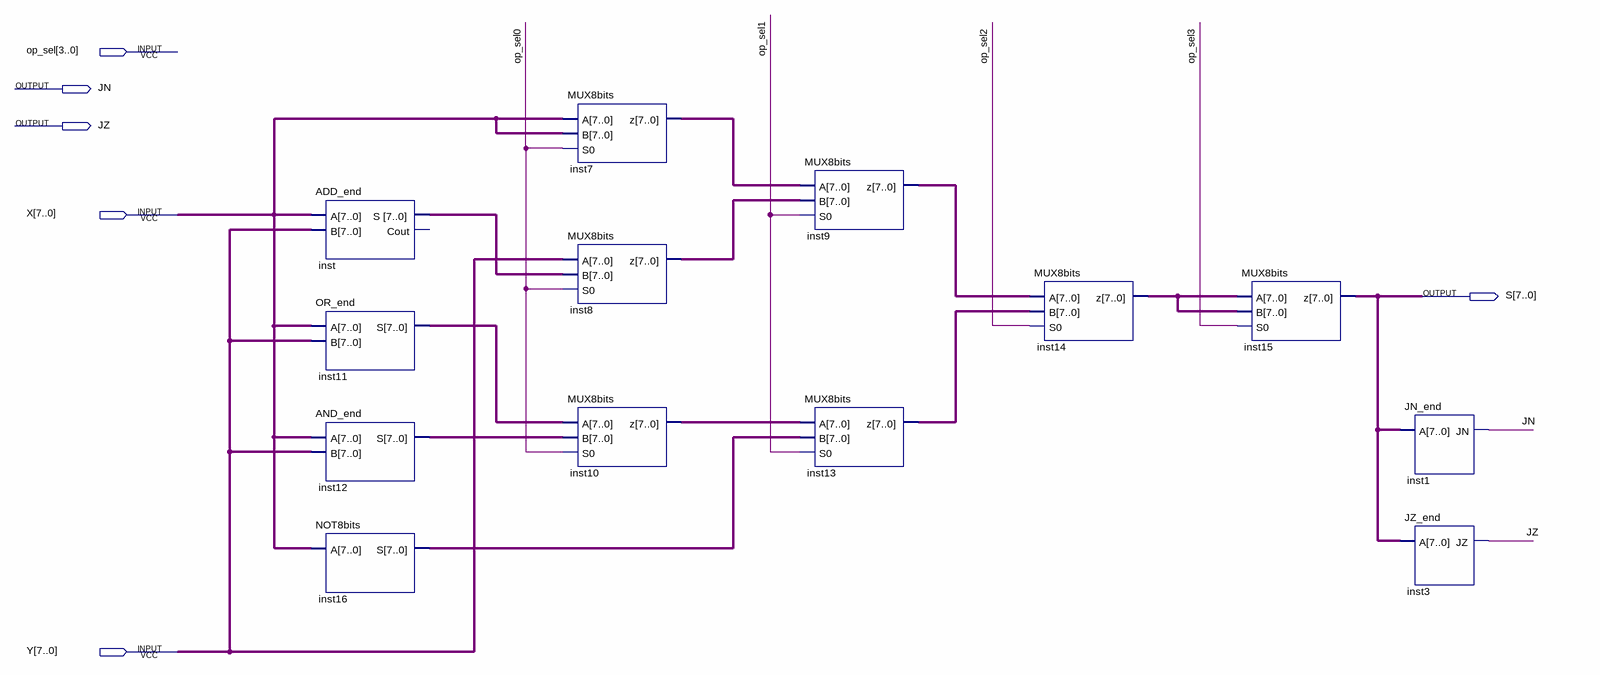
[diagram p0: schematic sheet]
// Quartus schematic ULA_Neander.bdf as structural Verilog: 13 symbols, 6 pins
module ULA_Neander (
  input  [3:0] op_sel,
  input  [7:0] X,
  input  [7:0] Y,
  output JN,
  output JZ,
  output [7:0] S
);

  wire [7:0] inst7_z, inst8_z, inst9_z, inst10_z, inst11_s, inst12_s, inst13_z, inst14_z, inst16_s, inst_s;

  ADD_end inst (.A(X), .B(Y), .S(inst_s));  // open: Cout
  OR_end inst11 (.A(X), .B(Y), .S(inst11_s));
  AND_end inst12 (.A(X), .B(Y), .S(inst12_s));
  NOT8bits inst16 (.A(X), .S(inst16_s));
  MUX8bits inst7 (.A(X), .B(X), .S0(op_sel[0]), .z(inst7_z));
  MUX8bits inst8 (.A(Y), .B(inst_s), .S0(op_sel[0]), .z(inst8_z));
  MUX8bits inst10 (.A(inst11_s), .B(inst12_s), .S0(op_sel[0]), .z(inst10_z));
  MUX8bits inst9 (.A(inst7_z), .B(inst8_z), .S0(op_sel[1]), .z(inst9_z));
  MUX8bits inst13 (.A(inst10_z), .B(inst16_s), .S0(op_sel[1]), .z(inst13_z));
  MUX8bits inst14 (.A(inst9_z), .B(inst13_z), .S0(op_sel[2]), .z(inst14_z));
  MUX8bits inst15 (.A(inst14_z), .B(inst14_z), .S0(op_sel[3]), .z(S));
  JN_end inst1 (.A(S), .JN(JN));
  JZ_end inst3 (.A(S), .JZ(JZ));
endmodule
